# EAGLE design benchBuddy (EAGLE 9.1.2)

## Sheet 1 of 2: PSU Schematic from Class
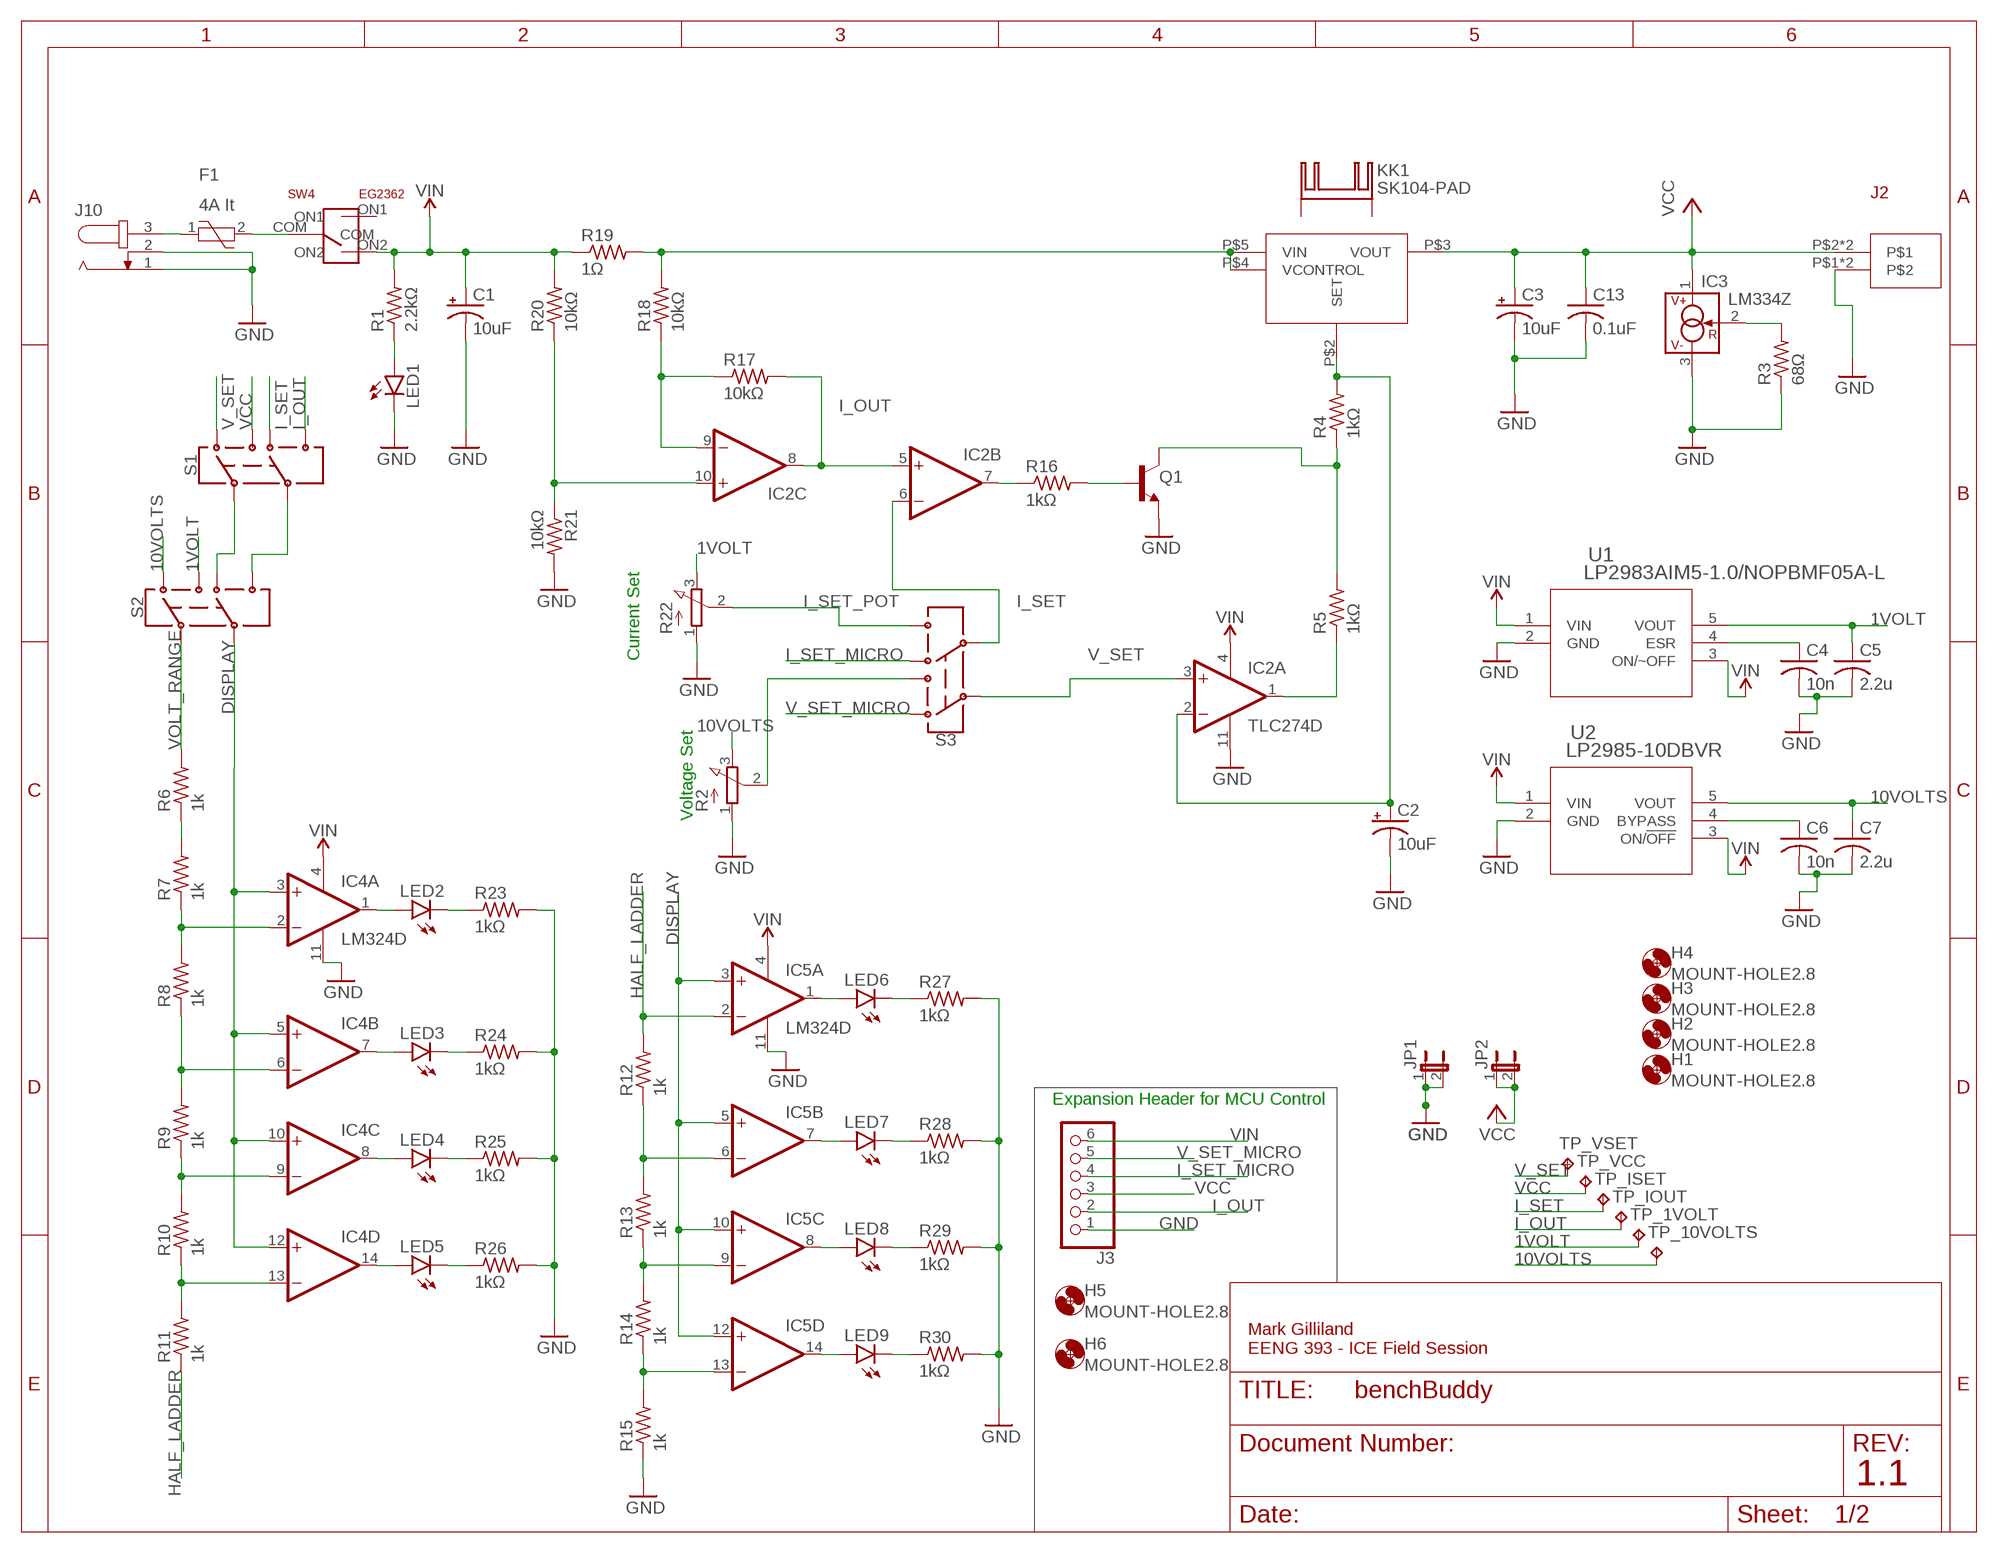
[diagram p0: schematic, sheet 1]

### Parts
C1  10uF  CPOL-USB  [PANASONIC_B]
C2  10uF  CPOL-USB  [PANASONIC_B]
C3  10uF  CPOL-USB  [PANASONIC_B]
C4  10n  C-USC1206  [C1206]
C5  2.2u  C-USC1206  [C1206]
C6  10n  C-USC1206  [C1206]
C7  2.2u  C-USC1206  [C1206]
C13  0.1uF  C-USC0805  [C0805]
F1  4A It  FUSE  [LITTELFUSE_MINISMDC260F/12-2]
H1  MOUNT-HOLE2.8  [2,8]
H2  MOUNT-HOLE2.8  [2,8]
H3  MOUNT-HOLE2.8  [2,8]
H4  MOUNT-HOLE2.8  [2,8]
H5  MOUNT-HOLE2.8  [2,8]
H6  MOUNT-HOLE2.8  [2,8]
IC2  TLC274D  [SO14]
IC3  LM334Z  [TO92]
IC4  LM324D  [SO14]
IC5  LM324D  [SO14]
J2  PHOENIX_SPRING_TERM_2POS  [SPRING_TERM_2POS]
J3  PINHD-1X6  [1X06]
J10  JACK-PLUG0  [SPC4077]
JP1  JP1E  [JP1]
JP2  JP1E  [JP1]
KK1  SK104-PAD  [SK104-PAD]
LED1  LEDCHIPLED_1206  [CHIPLED_1206]
LED2  LEDCHIPLED_1206  [CHIPLED_1206]
LED3  LEDCHIPLED_1206  [CHIPLED_1206]
LED4  LEDCHIPLED_1206  [CHIPLED_1206]
LED5  LEDCHIPLED_1206  [CHIPLED_1206]
LED6  LEDCHIPLED_1206  [CHIPLED_1206]
LED7  LEDCHIPLED_1206  [CHIPLED_1206]
LED8  LEDCHIPLED_1206  [CHIPLED_1206]
LED9  LEDCHIPLED_1206  [CHIPLED_1206]
Q1  600mA/40V  TRANS_NPN-MMBT2222AL  [SOT23-3]
R1  2.2kΩ  R-US_R1206  [R1206]
R2  EVUF2A  [EVUF]
R3  68Ω  R-US_R1206  [R1206]
R4  1kΩ  R-US_R1206  [R1206]
R5  1kΩ  R-US_R1206  [R1206]
R6  1k  R-US_R1206  [R1206]
R7  1k  R-US_R1206  [R1206]
R8  1k  R-US_R1206  [R1206]
R9  1k  R-US_R1206  [R1206]
R10  1k  R-US_R1206  [R1206]
R11  1k  R-US_R1206  [R1206]
R12  1k  R-US_R1206  [R1206]
R13  1k  R-US_R1206  [R1206]
R14  1k  R-US_R1206  [R1206]
R15  1k  R-US_R1206  [R1206]
R16  1kΩ  R-US_R1206  [R1206]
R17  10kΩ  R-US_R1206  [R1206]
R18  10kΩ  R-US_R1206  [R1206]
R19  1Ω  R-US_0411/15  [0411/15]
R20  10kΩ  R-US_R1206  [R1206]
R21  10kΩ  R-US_R1206  [R1206]
R22  EVUF2A  [EVUF]
R23  1kΩ  R-US_R1206  [R1206]
R24  1kΩ  R-US_R1206  [R1206]
R25  1kΩ  R-US_R1206  [R1206]
R26  1kΩ  R-US_R1206  [R1206]
R27  1kΩ  R-US_R1206  [R1206]
R28  1kΩ  R-US_R1206  [R1206]
R29  1kΩ  R-US_R1206  [R1206]
R30  1kΩ  R-US_R1206  [R1206]
S1  SWITCH-DPDT-SMD-AYZ0202  [SWITCH_DPDT_SMD_AYZ0202]
S2  SWITCH-DPDT-SMD-AYZ0202  [SWITCH_DPDT_SMD_AYZ0202]
S3  SWITCH-DPDT-SMD-AYZ0202  [SWITCH_DPDT_SMD_AYZ0202]
SW4  EG2362  [SWITCH_EG2362-ND]
TP_1VOLT  TPB1,27  [B1,27]
TP_10VOLTS  TPB1,27  [B1,27]
TP_IOUT  TPB1,27  [B1,27]
TP_ISET  TPB1,27  [B1,27]
TP_VCC  TPB1,27  [B1,27]
TP_VSET  TPB1,27  [B1,27]
U1  LP2983AIM5-1.0/NOPBMF05A-L  [MF05A-L]
U2  LP2985-10DBVR  [DBV5]
U$1  LT3080  [TO-220-5R]

### Nets
1VOLT: C5.1 R22.3(E) S2.3 TP_1VOLT.TP U1.5(VOUT) ; also sheet 2
10VOLTS: C7.1 R2.3(E) S2.1 TP_10VOLTS.TP U2.5(VOUT) ; also sheet 2
DISPLAY: IC4.3(A:+IN) IC4.5(B:+IN) IC4.10(C:+IN) IC4.12(D:+IN) IC5.3(A:+IN) IC5.5(B:+IN) IC5.10(C:+IN) IC5.12(D:+IN) S2.5
GND: C1.- C2.- C3.- C4.2 C5.2 C6.2 C7.2 C13.2 IC2.11(P:V-) IC3.3(V-) IC4.11(P:V-) IC5.11(P:V-) J2.P$1 J2.P$3 J3.1 J10.1 J10.2 JP1.1 JP1.2 LED1.C Q1.2(E) R2.1(A) R3.1 R15.1 R21.2 R22.1(A) R23.2 R24.2 R25.2 R26.2 R27.2 R28.2 R29.2 R30.2 U1.2(GND) U2.2(GND) ; also sheet 2
HALF_LADDER: IC5.2(A:-IN) R11.1 R12.2
I_OUT: IC2.5(B:+IN) IC2.8(C:OUT) J3.2 R17.2 S1.6 TP_IOUT.TP ; also sheet 2
I_SET: IC2.6(B:-IN) S1.4 S3.5 TP_ISET.TP ; also sheet 2
I_SET_MICRO: J3.4 S3.4
I_SET_POT: R22.2(S) S3.6
N$1: LED1.A R1.1
N$2: IC3.2(R) R3.2
N$3: F1.1 J10.3
N$5: Q1.3(C) R4.1 R5.2
N$6: C2.+ IC2.2(A:-IN) R4.2 U$1.P$2(SET)
N$8: R6.1 R7.2
N$9: IC5.13(D:-IN) R14.1 R15.2
N$10: IC5.9(C:-IN) R13.1 R14.2
N$11: IC5.6(B:-IN) R12.1 R13.2
N$13: IC4.2(A:-IN) R7.1 R8.2
N$14: IC4.6(B:-IN) R8.1 R9.2
N$15: IC4.9(C:-IN) R9.1 R10.2
N$16: IC4.13(D:-IN) R10.1 R11.2
N$17: IC2.10(C:+IN) R20.1 R21.1
N$18: IC2.9(C:-IN) R17.1 R18.1
N$19: R18.2 R19.2 U$1.P$4(VCONTROL) U$1.P$5(VIN)
N$20: C6.1 U2.4(BYPASS)
N$21: IC2.7(B:OUT) R16.1
N$23: Q1.1(B) R16.2
N$24: IC4.1(A:OUT) LED2.A
N$25: LED2.C R23.1
N$26: LED3.C R24.1
N$27: LED4.C R25.1
N$28: LED5.C R26.1
N$29: LED6.C R27.1
N$30: LED7.C R28.1
N$31: LED8.C R29.1
N$32: LED9.C R30.1
N$33: IC5.1(A:OUT) LED6.A
N$34: IC5.7(B:OUT) LED7.A
N$35: IC5.8(C:OUT) LED8.A
N$36: IC5.14(D:OUT) LED9.A
N$38: C4.1 U1.4(ESR)
N$39: S1.2 S2.4
N$40: S1.5 S2.6
N$44: F1.2 SW4.COM
N$45: IC4.7(B:OUT) LED3.A
N$46: IC4.8(C:OUT) LED4.A
N$47: IC4.14(D:OUT) LED5.A
V_OUT: IC2.1(A:OUT) R5.1
V_SET: IC2.3(A:+IN) S1.1 S3.2 TP_VSET.TP ; also sheet 2
V_SET_MICRO: J3.5 S3.1
V_SET_POT: R2.2(S) S3.3
VCC: C3.+ C13.1 IC3.1(V+) J2.P$2 J2.P$4 J3.3 JP2.1 JP2.2 S1.3 TP_VCC.TP U$1.P$3(VOUT) ; also sheet 2
VIN: C1.+ IC2.4(P:V+) IC4.4(P:V+) IC5.4(P:V+) J3.6 R1.2 R19.1 R20.2 SW4.ON2 U1.1(VIN) U1.3(ON/~OFF) U2.1(VIN) U2.3(ON/!OFF) ; also sheet 2
VOLT_RANGE: R6.2 S2.2
Unconnected: IC2.12(D:+IN) IC2.13(D:-IN) IC2.14(D:OUT) KK1.K1(K) KK1.K2(K)

### Notes on the sheet
- Current Set
- Voltage Set
- Expansion Header for MCU Control
- Mark Gilliland
  EENG 393 - ICE Field Session
- 1.1

## Sheet 2 of 2: Extra Power Supplies
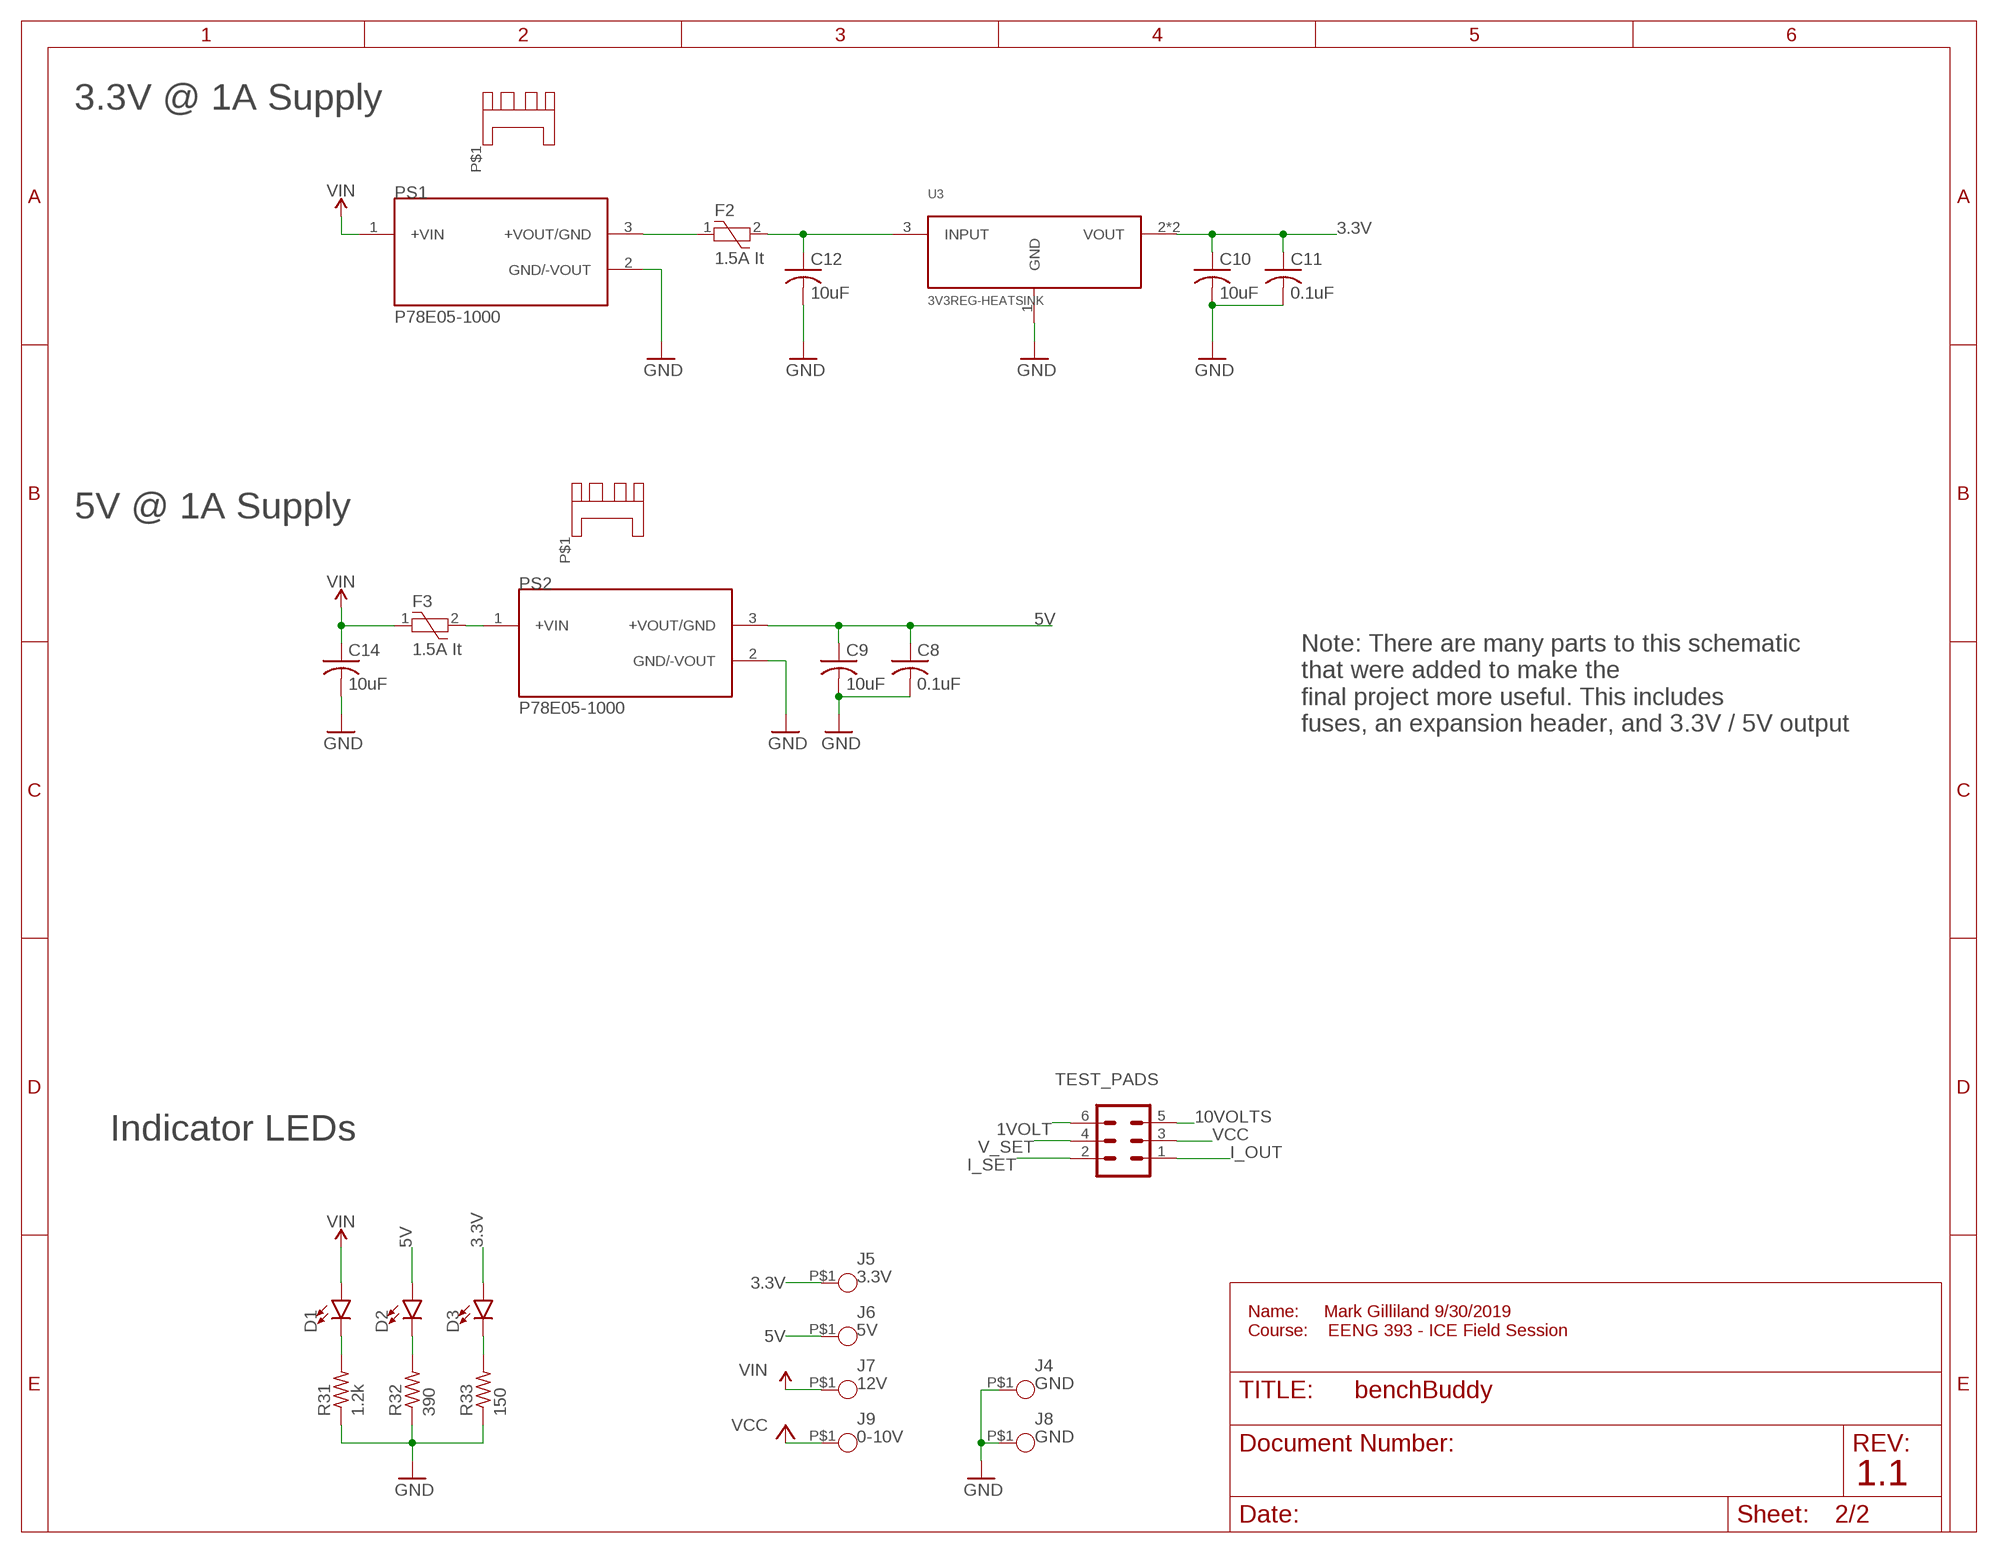
[diagram p1: schematic, sheet 2]

### Parts
C8  0.1uF  C-USC0805  [C0805]
C9  10uF  C-USC0805  [C0805]
C10  10uF  C-USC0805  [C0805]
C11  0.1uF  C-USC0805  [C0805]
C12  10uF  C-USC0805  [C0805]
C14  10uF  C-USC0805  [C0805]
D1  LED3MM  [LED_3MM]
D2  LED3MM  [LED_3MM]
D3  LED3MM  [LED_3MM]
F2  1.5A It  FUSE  [LITTELFUSE_MINISMDC260F/12-2]
F3  1.5A It  FUSE  [LITTELFUSE_MINISMDC260F/12-2]
J4  GND  FAT-WIRE-TERM  [FAT-PAD]
J5  3.3V  FAT-WIRE-TERM  [FAT-PAD]
J6  5V  FAT-WIRE-TERM  [FAT-PAD]
J7  12V  FAT-WIRE-TERM  [FAT-PAD]
J8  GND  FAT-WIRE-TERM  [FAT-PAD]
J9  0-10V  FAT-WIRE-TERM  [FAT-PAD]
PS1  P78E05-1000  [CONV_P78E05-1000]
PS2  P78E05-1000  [CONV_P78E05-1000]
R31  1.2k  R-US_R1206  [R1206]
R32  390  R-US_R1206  [R1206]
R33  150  R-US_R1206  [R1206]
TEST_PADS  CONN_03X2NO_SILK  [2X3-NS]
U3  3V3REG-HEATSINK  [SOT223-HS]
U$2  HEATSINK_MINI  [HEATSINK_MINI]
U$3  HEATSINK_MINI  [HEATSINK_MINI]

### Nets
1VOLT: TEST_PADS.6 ; also sheet 1
3.3V: C10.1 C11.1 D3.A J5.P$1 U3.2(VOUT) U3.4(VOUT)
5V: C8.1 C9.1 D2.A J6.P$1 PS2.3(+VOUT/GND)
10VOLTS: TEST_PADS.5 ; also sheet 1
GND: C8.2 C9.2 C10.2 C11.2 C12.2 C14.2 J4.P$1 J8.P$1 PS1.2(GND/-VOUT) PS2.2(GND/-VOUT) R31.1 R32.1 R33.1 U3.1(GND) ; also sheet 1
I_OUT: TEST_PADS.1 ; also sheet 1
I_SET: TEST_PADS.2 ; also sheet 1
N$7: F3.2 PS2.1(+VIN)
N$41: D1.K(C) R31.2
N$42: D2.K(C) R32.2
N$43: D3.K(C) R33.2
N$48: F2.1 PS1.3(+VOUT/GND)
N$49: C12.1 F2.2 U3.3(INPUT)
V_SET: TEST_PADS.4 ; also sheet 1
VCC: J9.P$1 TEST_PADS.3 ; also sheet 1
VIN: C14.1 D1.A F3.1 J7.P$1 PS1.1(+VIN) ; also sheet 1
Unconnected: U$2.P$1 U$3.P$1

### Notes on the sheet
- 3.3V @ 1A Supply
- 5V @ 1A Supply
- Note: There are many parts to this schematic
  that were added to make the
  final project more useful. This includes
  fuses, an expansion header, and 3.3V / 5V output
- Indicator LEDs
- Name:     Mark Gilliland 9/30/2019
  Course:    EENG 393 - ICE Field Session
- 1.1

## Power pins joined to a net without a drawn wire
ON1: SW4.ON1

## Library data of the parts
C1-C3 = rcl:CPOL-US: POLARIZED CAPACITOR, American symbol; SPICEPREFIX: C
C4-C14 = rcl:C-US: CAPACITOR, American symbol; SPICEPREFIX: C
D1-D3 = SparkFun-LED:LED: LED (Generic) Standard schematic elements and footprints for 5mm, 3mm, 1206, and 0603 sized LEDs. Generic LEDs with no color specified.; PROD_ID: DIO-08794
F1-F3 = lab07lib:FUSE
H1-H6 = holes:MOUNT-HOLE: MOUNTING HOLE with drill center marker
IC2 = linear:TLC274: OP AMP
IC3 = linear:LM*34: 3-Terminal Adjustable Current Sources Source: www.national.com/pf/LM/LM334.html | LM134.pdf
IC4 IC5 = linear:LM324: OP AMP
J2 = lab07lib:PHOENIX_SPRING_TERM_2POS
J3 = pinhead:PINHD-1X6: PIN HEADER
J4-J9 = lab07lib:FAT-WIRE-TERM: Fat wire terminal, for 14AWG wire connections. Provides fat pad so that it doesn't get torn off.
J10 = con-jack:JACK-PLUG: DC POWER JACK Power Jack, DC, Right Angle, Through Hole, Rated 5A at 16VDC, PC Terminals Distributor: Farnell (www.Farnell.de) Drawing: 84N1161.pdf / 84N1162.pdf Manufacturer: SPC Technology (www.spctechnology.com) Type: SPC4077 / SPC 4078; OC_FARNELL: unknown; OC_NEWARK: unknown
JP1 JP2 = jumper:JP1E: JUMPER
KK1 = heatsink:SK104-PAD: HEATSINK manufacturer Fischer/distributor Buerklin
LED1-LED9 = led:LED: LED OSRAM: - CHIPLED LG R971, LG N971, LY N971, LG Q971, LY Q971, LO R971, LY R971 LH N974, LH R974 LS Q976, LO Q976, LY Q976 LO Q996 - Hyper CHIPLED LW Q18S LB Q993, LB Q99A, LB R99A - SideLED LS A670, LO A670, LY A670, LG A670, LP A670 LB A673, LV A673, LT A673, LW A673 LH A674 LY A675 LS A676, LA A676, LO A676, LY A676, LW A676 LS A679, LY A679, LG A679 - Hyper Micro SIDELED® LS Y876, LA Y876, LO Y876, LY Y876 LT Y87S - SmartLED LW L88C, LW L88S LB L89C, LB L89S, LG L890 LS L89K, LO L89K, LY L89K LS L896, LA L896, LO L896, LY L896 - TOPLED LS T670, LO T670, LY T670, LG T670, LP T670 LSG T670, LSP T670, LSY T670, LOP T670, LYG T670 LG T671, LOG T671, LSG T671 LB T673, LV T673, LT T673, LW T673 LH T674 LS T676, LA T676, LO T676, LY T676, LB T676, LH T676, LSB T676, LW T676 LB T67C, LV T67C, LT T67C, LS T67K, LO T67K, LY T67K, LW E67C LS E67B, LA E67B, LO E67B, LY E67B, LB E67C, LV E67C, LT E67C LW T67C LS T679, LY T679, LG T679 LS T770, LO T770, LY T770, LG T770, LP T770 LB T773, LV T773, LT T773, LW T773 LH T774 LS E675, LA E675, LY E675, LS T675 LS T776, LA T776, LO T776, LY T776, LB T776 LHGB T686 LT T68C, LB T68C - Hyper Mini TOPLED® LB M676 - Mini TOPLED Santana® LG M470 LS M47K, LO M47K, LY M47K Source: http://www.osram.convergy.de LUXEON: - LUMILED® LXK2-PW12-R00, LXK2-PW12-S00, LXK2-PW14-U00, LXK2-PW14-V00 LXK2-PM12-R00, LXK2-PM12-S00, LXK2-PM14-U00 LXK2-PE12-Q00, LXK2-PE12-R00, LXK2-PE12-S00, LXK2-PE14-T00, LXK2-PE14-U00 LXK2-PB12-K00, LXK2-PB12-L00, LXK2-PB12-M00, LXK2-PB14-N00, LXK2-PB14-P00, LXK2-PB14-Q00 LXK2-PR12-L00, LXK2-PR12-M00, LXK2-PR14-Q00, LXK2-PR14-R00 LXK2-PD12-Q00, LXK2-PD12-R00, LXK2-PD12-S00 LXK2-PH12-R00, LXK2-PH12-S00 LXK2-PL12-P00, LXK2-PL12-Q00, LXK2-PL12-R00 Source: www.luxeon.com KINGBRIGHT: KA-3528ASYC Source: www.kingbright.com
PS1 PS2 = P78E05-1000:P78E05-1000: NON-ISOLATED DC SWITCHING REGULATOR; MANUFACTURER: CUI Inc; STANDARD: Manufacturer Recommendations
Q1 = SparkFun-DiscreteSemi:TRANS_NPN: NPN transistor Current controlled devices typically used to amplify current or used as a switch. BC547 - COM-08928 <http://www.sparkfun.com/products/8928> (TO-92 45V 100mA) (1.Collector 2.Base 3.Emitter) 2N3904 - COM-00521 <http://www.sparkfun.com/products/521> (TO-92 40V 200mA) (1.Emitter 2.Base 3.Collector) P2N2222A - COM-12852 <http://www.sparkfun.com/products/12852> (TO-92 40V 600mA) (1.Collector 2.Base 3.Emitter); PROD_ID: TRANS-08049
R1 R3-R21 R23-R33 = rcl:R-US_: RESISTOR, American symbol; SPICEPREFIX: R
R2 R22 = pot:EVU: 9 mm Square Rotary Potentiometers Source: Panasonic
S1-S3 = SparkFun-Switches:SWITCH-DPDT: Double-Pole, Double-Throw (DPDT) Switch Double-pole, double-throw switches. Variant Overview PTH-GPI-152-3013 Used on SparkFun Geiger Counter <https://www.sparkfun.com/products/11345> SMD-AY0202 Surface Mount DPDT Switch <https://www.sparkfun.com/products/597> (COM-00597) Used on e.g. LilyPad Arduino USB - ATmega32U4 Board <https://www.sparkfun.com/products/12049>; PROD_ID: SWCH-08179; SF_SKU: COM-00597
SW4 = lab07lib:EG2362
TEST_PADS = SparkFun-Connectors:CONN_03X2: Multi connection point. Often used as Generic Header-pin footprint for 0.1 inch spaced/style header connections You can populate with any combo of single row headers, but if you'd like an exact match, check these: Header - 2x3 (Male, 0.1") <https://www.sparkfun.com/products/12807> (PRT-12807) Header - 2x3 (Female, 0.1") <https://www.sparkfun.com/products/13010> (PRT-13010) 2x3 Pin Shrouded Header <https://www.sparkfun.com/products/10877> (PRT-10877) On any of the 0.1 inch spaced packages, you can populate with these: Break Away Headers - Straight <https://www.sparkfun.com/products/116> (PRT-00116) Break Away Male Headers - Right Angle <https://www.sparkfun.com/products/553> (PRT-00553) Female Headers <https://www.sparkfun.com/products/115> (PRT-00115) Break Away Headers - Machine Pin <https://www.sparkfun.com/products/117> (PRT-00117) Break Away Female Headers - Swiss Machine Pin <https://www.sparkfun.com/products/743> (PRT-00743) Special note: the shrouded connector mates well with our 3x2 ribbon cables: Ribbon Crimp Connector - 6-pin (2x3, Female) <https://www.sparkfun.com/products/10651> (PRT-10651) Ribbon Cable - 6 wire (15ft) <https://www.sparkfun.com/products/10646> (PRT-10646)
TP_1VOLT TP_10VOLTS TP_IOUT TP_ISET TP_VCC TP_VSET = testpad:TP: Test pad
U1 = lab07lib:LP2983AIM5-1.0/NOPB; MANUFACTURER_PART_NUMBER: LP2983AIM51.0NOPB; VENDOR: Texas Instruments
U2 = lab07lib:LP2985-10DBVR; MANUFACTURER_PART_NUMBER: LP298510DBVR; VENDOR: Texas Instruments
U3 = lab07lib:3V3REG: Cheap 3.3V VReg, Linear SOT223, 1A AP2114HA-3.3TRG1
U$1 = lab07lib:LT3080
U$2 U$3 = lab07lib:HEATSINK_MINI

## Board
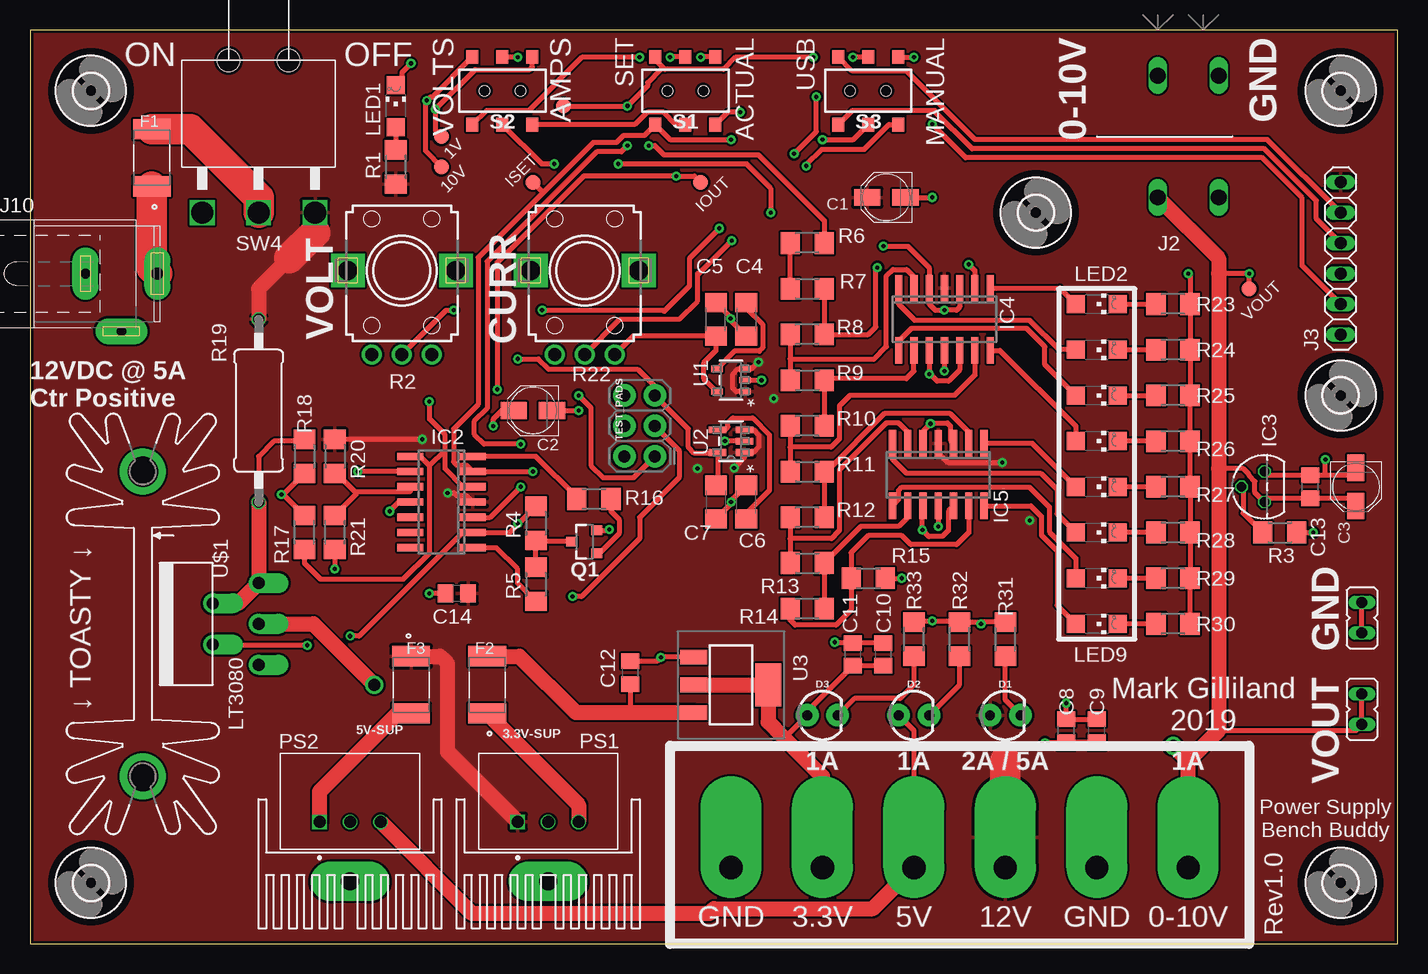
[diagram p2: board, top side]
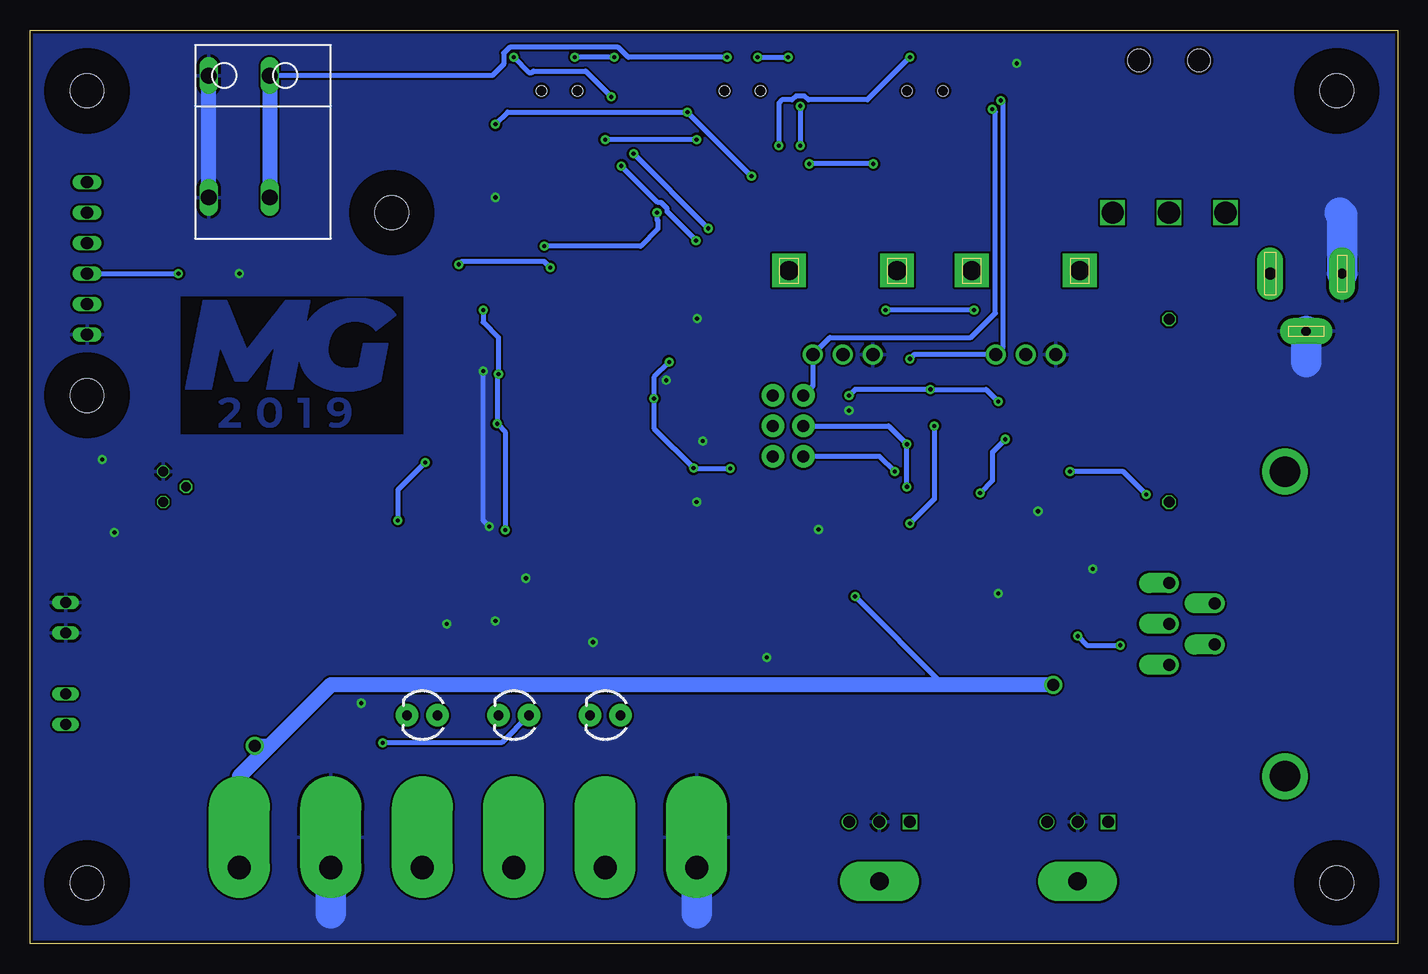
[diagram p3: board, bottom side, seen from below]

Size 113.97 x 76.19 mm. Coordinates in mm from the lower left corner, seen from the top.
Outline: 0,0 113.97,0 113.97,76.19 0,76.19 0,0
Copper layers (1*16): Top 0.0356mm / dielectric 1.5011mm / Bottom 0.0356mm
Design rules "PCBway": minimum track width 7mil, minimum drill 10mil, track to track 7mil, track to pad 7mil, pad to pad 7mil, via to via 7mil, smd to smd 0mil, copper to edge 10mil, drill to drill 10mil, minimum pad ring 4mil, minimum via ring 8mil, stop-mask expansion 4mil, vias tented up to drill 0mil, thermal gap 10mil
bKeepout: area 82.9,42.5 to 101.4,42.5; area 82.9,42.5 to 101.4,42.5; area 82.9,42.5 to 101.4,42.6; area 82.9,42.6 to 101.4,42.6; area 82.9,42.6 to 101.4,42.6; area 82.9,42.6 to 101.4,42.7; area 82.9,42.7 to 101.4,42.7; area 82.9,42.7 to 101.4,42.7; area 82.9,42.7 to 101.4,42.7; area 82.9,42.7 to 101.4,42.8; area 82.9,42.8 to 101.4,42.8; area 82.9,42.8 to 101.4,42.8; 1752 more areas
bRestrict: area 82.9,42.5 to 101.4,42.5; area 82.9,42.5 to 101.4,42.5; area 82.9,42.5 to 101.4,42.6; area 82.9,42.6 to 101.4,42.6; area 82.9,42.6 to 101.4,42.6; area 82.9,42.6 to 101.4,42.7; area 82.9,42.7 to 101.4,42.7; area 82.9,42.7 to 101.4,42.7; area 82.9,42.7 to 101.4,42.7; area 82.9,42.7 to 101.4,42.8; area 82.9,42.8 to 101.4,42.8; area 82.9,42.8 to 101.4,42.8; 1752 more areas

### Footprints (pad centres in the part's own frame; a part is rotated, then mirrored left to right if it is on the bottom)
PANASONIC_B = smd 2.2 x 1.4: + 1.6,0; - -1.6,0
C1206 = smd 1.6 x 1.8: 1 -1.4,0; 2 1.4,0
C0805 = smd 1.3 x 1.5: 1 -0.95,0; 2 0.95,0
LED_3MM = drill 0.813 pad 1.88: A -1.27,0; K 1.27,0
LITTELFUSE_MINISMDC260F/12-2 = smd 1.68 x 3.15: 1 -2.39,0; 2 2.39,0
2,8 = hole 2.8: 0,0
SO14 = smd 0.6 x 2.2: 1 -3.81,-2.6; 2 -2.54,-2.6; 3 -1.27,-2.6; 4 0,-2.6; 5 1.27,-2.6; 6 2.54,-2.6; 7 3.81,-2.6; 8 3.81,2.6; 9 2.54,2.6; 10 1.27,2.6; 11 0,2.6; 12 -1.27,2.6; 13 -2.54,2.6; 14 -3.81,2.6
TO92 = drill 0.813 octagon: 1 -1.27,0; 2 0,1.905; 3 1.27,0
SPRING_TERM_2POS = drill 1.321 long: P$1 5.08,0; P$2 0,0; P$3 5.08,10.16; P$4 0,10.16
1X06 = drill 1.016 long: 1 -6.35,0; 2 -3.81,0; 3 -1.27,0; 4 1.27,0; 5 3.81,0; 6 6.35,0
FAT-PAD = drill 1.93 pad 5.08 offset: P$1 0,0
SPC4077 = drill 0.8 pad 2.184 long: 1 -3,0; 2 0,-4.8 | drill 1 pad 2.184 long: 3 3,0
JP1 = drill 0.914 long: 1 0,-1.27; 2 0,1.27
SK104-PAD = drill 2.54 pad 3.81: K1 -12.7,-0.762; K2 12.7,-0.762
CHIPLED_1206 = smd 1.5 x 1.5: A 0,-1.75; C 0,1.75
CONV_P78E05-1000 = drill 1 square: 1 -2.54,0 | drill 1: 2 0,0; 3 2.54,0
SOT23-3 = smd 0.8 x 0.9: 1 -0.95,-1; 2 0.95,-1; 3 0,1.1
R1206 = smd 1.6 x 1.803: 1 -1.422,0; 2 1.422,0
EVUF = drill 1.1 pad 1.676: 1 -2.5,-7; 2 0,-7; 3 2.5,-7 | drill 1.6 pad 2.8 square: M1 4.5,0; M2 -4.5,0
0411/15 = drill 0.914 octagon: 1 -7.62,0; 2 7.62,0
SWITCH_DPDT_SMD_AYZ0202 = smd 1 x 1.15: 1 -2.5,2.825; 2 0,2.825; 3 2.5,2.825; 4 -2.5,-2.825; 5 0,-2.825; 6 2.5,-2.825 | hole 0.85: 1.5,0; -1.5,0
SWITCH_EG2362-ND = drill 1.85 square: COM 0,0; ON1 -4.7,0; ON2 4.7,0 | hole 1.85: 2.5,12.7; -2.5,12.7
2X3-NS = drill 1.016 pad 1.88: 1 -2.54,-1.27; 2 -2.54,1.27; 3 0,-1.27; 4 0,1.27; 5 2.54,-1.27; 6 2.54,1.27
B1,27 = smd 1.27 x 1.27: TP 0,0
MF05A-L = smd 0.965 x 0.508: 1 -1.168,0.953; 2 -1.168,0; 3 -1.168,-0.953; 4 1.168,-0.953; 5 1.168,0.953
DBV5 = smd 1.473 x 0.559: 1 -1.118,0.95; 2 -1.118,0; 3 -1.118,-0.95; 4 1.118,-0.95; 5 1.118,0.95
SOT223-HS = smd 1.219 x 2.235: 1 -2.311,-3.099; 2 0,-3.099; 3 2.311,-3.099 | smd 3.6 x 2.2: 4 0,3.099
TO-220-5R = drill 1 pad 1.676 offset: P$1 -3.404,-3.81; P$2 -1.727,0; P$3 0,-3.81; P$4 1.727,0; P$5 3.404,-3.81
HEATSINK_MINI = drill 1.524 pad 3.302 long: P$1 0,2.413

### Placement (x,y rotation side)
C1  71.37,62.23 180 top
C2  41.91,44.45 180 top
C3  110.49,38.1 270 top
C4  59.69,52.07 270 top
C5  57.15,52.07 90 top
C6  59.69,36.83 90 top
C7  57.15,36.83 270 top
C8  86.36,17.78 90 top
C9  88.9,17.78 90 top
C10  71.12,24.13 90 top
C11  68.58,24.13 90 top
C12  50.04,22.61 90 top
C13  106.68,38.1 90 top
C14  35.56,29.21 180 top
D1  81.28,19.05 0 top
D2  73.66,19.05 0 top
D3  66.04,19.05 0 top
F1  10.16,65.53 90 top
F2  38.1,21.59 90 top
F3  31.75,21.59 270 top
H1  5.08,5.08 0 top
H2  109.22,71.12 0 top
H3  109.22,5.08 0 top
H4  5.08,71.12 0 top
H5  109.22,45.72 0 top
H6  83.82,60.96 0 top
IC2  34.29,36.83 90 top
IC3  102.87,38.1 90 top
IC4  76.2,52.07 180 top
IC5  75.69,39.12 180 top
J2  93.98,62.23 0 top
J3  109.22,57.15 90 top
J4  58.42,6.35 0 top
J5  66.04,6.35 0 top
J6  73.66,6.35 0 top
J7  81.28,6.35 0 top
J8  88.9,6.35 0 top
J9  96.52,6.35 0 top
J10  7.62,55.88 0 top
JP1  111,27.18 0 top
JP2  111,19.56 0 top
KK1  10.16,26.67 270 top
LED1  30.48,69.85 0 top
LED2  88.9,53.34 270 top
LED3  88.9,49.53 270 top
LED4  88.9,45.72 270 top
LED5  88.9,41.91 270 top
LED6  88.9,38.1 270 top
LED7  88.9,34.29 270 top
LED8  88.9,30.48 270 top
LED9  88.9,26.67 270 top
PS1  43.18,10.16 0 top
PS2  26.67,10.16 0 top
Q1  46.23,33.53 90 top
R1  30.48,64.77 270 top
R2  30.99,56.13 0 top
R3  104.14,34.29 180 top
R4  42.16,35.05 90 top
R5  42.16,29.97 90 top
R6  64.77,58.42 0 top
R7  64.77,54.61 180 top
R8  64.77,50.8 0 top
R9  64.77,46.99 180 top
R10  64.77,43.18 0 top
R11  64.77,39.37 180 top
R12  64.77,35.56 0 top
R13  64.77,31.75 180 top
R14  64.77,27.94 0 top
R15  69.85,30.48 180 top
R16  46.99,37.08 0 top
R17  22.86,34.29 270 top
R18  22.86,40.64 90 top
R19  19.05,44.45 270 top
R20  25.4,40.64 90 top
R21  25.4,34.29 270 top
R22  46.23,56.13 0 top
R23  95.25,53.34 0 top
R24  95.25,49.53 0 top
R25  95.25,45.72 0 top
R26  95.25,41.91 0 top
R27  95.25,38.1 0 top
R28  95.25,34.29 0 top
R29  95.25,30.48 0 top
R30  95.25,26.67 0 top
R31  81.28,25.4 270 top
R32  77.47,25.4 270 top
R33  73.66,25.4 270 top
S1  54.61,71.12 0 top
S2  39.37,71.12 0 top
S3  69.85,71.12 0 top
SW4  19.05,60.96 0 top
TEST_PADS  50.8,43.18 90 top
TP_1VOLT  34.29,67.31 180 top
TP_10VOLTS  34.29,64.77 180 top
TP_IOUT  55.88,63.5 180 top
TP_ISET  41.91,63.5 180 top
TP_VCC  101.6,54.61 180 top
TP_VSET  44.45,69.85 180 top
U1  58.42,46.99 180 top
U2  58.42,41.91 180 top
U3  58.42,21.59 270 top
U$1  15.24,26.67 90 top
U$2  43.18,7.62 180 top
U$3  26.67,7.62 180 top

### Tracks (layer width: path | path; a pad name or v marks a point on that pad's centre or on a via)
1VOLT  (via drill 0.35)
  Top 0.406: U1.5 56.11,47.13 56.11,48.41 57.15,49.45 C5.1 50.26,50.67 R22.3 | S2.3 41.87,73.11 41.66,72.9 37.08,72.9 v33.78,69.6 33.78,67.82 TP_1VOLT.TP
  Bottom 0.406: v33.78,69.6 33.53,69.34 33.53,52.58 35.56,50.55 47.32,50.55 R22.3 48.73,46.52 TEST_PADS.6
3.3V
  Top 0.406: C10.1 C11.1 64.77,19.37 D3.A 62.99,17.27 62.74,17.27
  Top 1.27: J5.P$1 66.04,13.97 62.74,17.27 61.52,18.49 U3.4 U3.2
5V  (via drill 0.35)
  Top 0.406: D2.A 73.66,17.78 J6.P$1 | C9.1 C8.1 86.29,16.76 v84.58,16.76
  Top 1.27: J6.P$1 70.23,2.92 57,2.92 56.62,2.54 36.83,2.54 PS2.3
  Bottom 0.406: v84.58,16.76 74.68,16.76 D2.A
10VOLTS  (via drill 0.35, 0.35 pad 0.7)
  Top 0.406: C7.1 57.3,38.38 U2.5 57.24,40.89 55.37,40.89 54.86,41.4 54.86,42.93 52.61,45.18 52.07,45.18 TEST_PADS.5 52.07,46.48 50.64,47.91 43.22,47.91 42.37,48.77 v40.64,48.77 | S2.1 33.53,70.6 33.36,70.6 v33.07,70.31 33.07,70.06 32.95,69.94 32.95,66.11 TP_10VOLTS.TP
  Bottom 0.406: v33.07,70.31 32.87,70.11 32.87,49.75 R2.3 40.27,49.13 v40.64,48.77
DISPLAY  (via drill 0.35)
  Top 0.406: IC5.5 74.42,42.74 v75.04,43.36 75.12,43.43 76.45,43.43 76.71,43.18 76.71,41.97 IC5.3 | IC4.12 77.47,47.84 76.55,46.92 75.6,46.92 75.02,47.5 v74.93,47.5 IC4.10 | IC5.12 76.53,36.08 76.53,34.45 76.04,33.96 74.96,33.96 74.93,33.93 v74.37,34.49 74.37,36.47 IC5.10 | IC4.3 77.47,53.09 77.22,52.83 v76.2,52.83 75.44,52.83 74.93,53.34 IC4.5 74.93,56.39 73.15,58.17 v71.12,58.17 | S2.5 42.64,65.02 v43.69,65.02 | v49.02,65.02 59.69,65.02 61.72,62.99 v61.72,60.96
  Bottom 0.406: v76.2,52.83 76.2,51.82 74.93,50.55 v74.93,47.5 75.04,47.38 v75.04,43.36 74.37,42.69 v74.37,34.49 | v43.69,65.02 v49.02,65.02 | v61.72,60.96 61.72,60.37 61.65,60.3 61.65,59.61 63.09,58.17 v71.12,58.17
GND  (via drill 0.35)
  Top 0.406: R30.2 R29.2 R28.2 R27.2 R26.2 R25.2 R24.2 R23.2 96.67,55.73 v96.52,55.88 | C3.- 109.84,39.05 107.95,39.05 | 107.95,39.05 C13.2 103.19,39.05 IC3.3 | IC4.11 v76.2,47.75 | IC5.11 v75.69,34.8 | R21.2 v25.4,31.24 | IC2.11 30.73,36.83 v29.97,36.07 | Q1.2 48.19,34.48 v48.26,34.54 | 73.51,26.67 R33.1 73.76,26.92 v75.18,26.92 77.37,26.92 R32.1 79.1,26.82 v79.25,26.67 79.4,26.82 R31.1 | C10.2 C11.2 67.12,25.08 v67.06,25.15 | U3.1 52.6,23.9 v52.58,23.88 52.26,23.56 C12.2 | C9.2 C8.2 v86.36,20.07 | C2.- v45.72,44.45 | C7.2 58.42,36.7 v58.42,36.83 58.42,36.96 C6.2 | C5.2 58.38,52.24 v58.38,52.13 58.38,51.98 C4.2 | U1.2 v60.96,46.99 | C1.- v75.18,62.23 | C14.2 v33.27,29.21 | U2.2 v57.91,41.91 | JP1.1 JP1.2 | v31.75,73.41 30.99,72.64 30.99,72.11 LED1.C | R15.1 v72.64,30.48 | R3.1 v106.93,34.29 | 107.95,39.05 v107.95,40.39
  Bottom 0.406: v75.69,34.8 76.2,35.31 v76.2,47.75
  Bottom 1.27: J2.P$1 J2.P$3
  Bottom 2.54: J4.P$1 58.42,2.54 | J8.P$1 88.9,2.54 | J10.1 4.62,60.75 4.83,60.96 | J10.2 7.62,48.51
  pour Bottom: 113.97,0 0,0 0,76.19 113.97,76.19
  pour Bottom (no thermals): 82.8,54.36 101.6,54.36 101.6,42.16 82.8,42.16
HALF_LADDER
  Top 0.406: R12.2 R11.1 66.38,39.37 71.2,44.2 76.71,44.2 78.23,42.67 IC5.2
I_OUT  (via drill 0.35)
  Top 0.406: 33.27,39.88 32.51,40.64 IC2.8 | 33.27,39.88 33.27,32.56 31.12,30.41 24.2,30.41 22.86,31.75 R17.2 | IC2.5 36.11,38.1 34.59,39.62 34.59,41.19 | 34.59,41.19 34.59,42.46 33.27,43.78 v33.27,45.21 | 33.27,39.88 33.29,39.88 34.59,41.19 | J3.2 106.02,56.54 106.02,62.21 102.7,65.53 77.98,65.53 v75.18,68.33 | v59.18,69.34 58.16,69.34 S1.6 | v38.94,46.23 38.94,56.8 46.15,64.01 v53.85,64.01 55.37,64.01 TP_IOUT.TP | v45.72,45.72 46.74,44.7 46.74,39.88 47.75,38.86 50.29,38.86 TEST_PADS.1
  Bottom 0.406: v75.18,68.33 74.17,69.34 v59.18,69.34 v53.85,64.01 | v33.27,45.21 34.29,46.23 v38.94,46.23 45.21,46.23 v45.72,45.72
I_SET  (via drill 0.35)
  Top 0.406: S3.5 68.61,67.06 v66.04,67.06 | v58.42,67.06 53.34,67.06 52.11,68.29 S1.4 51.2,67.38 49.44,67.38 48.86,66.8 46.93,66.8 42.77,62.64 | 42.77,62.64 37.34,57.22 37.34,44.97 35.31,42.93 35.31,40.18 35.6,39.88 36.38,39.88 IC2.6 v41.91,39.37 | TP_ISET.TP 42.77,62.64
  Bottom 0.406: v58.42,67.06 v66.04,67.06 | v41.91,39.37 43.18,40.64 TEST_PADS.2
I_SET_MICRO
  Top 0.406: J3.4 107.19,60.45 107.19,61.98 102.87,66.29 78.51,66.29 75.41,69.39 75.41,69.48 68.53,69.48 S3.4
I_SET_POT  (via drill 0.35)
  Top 0.406: R22.2 49.16,52.07 54.1,52.07 55.63,53.59 55.63,55.88 55.72,55.88 v58.47,58.62 | S3.6 71.57,68.3 69.5,66.22 65.97,66.22 64.69,64.95 v64.69,64.85
  Bottom 0.406: v58.47,58.62 60.89,61.04 60.89,61.31 61.38,61.8 61.64,61.8 v64.69,64.85
N$1
  Top 0.406: LED1.A R1.1
N$2
  Top 0.406: IC3.2 101.09,37.97 101.09,35.92 R3.2
N$3
  Top 2.54: F1.1 10.16,56.34 J10.3
N$5
  Top 0.406: R5.2 R4.1 42.27,33.53 Q1.3
N$6  (via drill 0.35)
  Top 0.406: C2.+ 39.29,44.45 38.61,43.76 v38.61,43.18 | R4.2 40.74,35.05 v40.64,35.05 40.64,34.95 39.98,34.29 IC2.2 36.07,34.29 27.43,25.65 v26.67,25.65 | v23.11,24.89 15.29,24.89 U$1.P$2
  Bottom 0.406: v38.61,43.18 38.61,37.08 v40.64,35.05 | v26.67,25.65 25.91,24.89 v23.11,24.89
N$7
  Top 1.27: PS2.1 24.13,12.7 30.63,19.2 F3.2
N$8
  Top 0.406: R7.2 R6.1
N$9
  Top 0.406: IC5.13 78.23,34.29 77.22,33.27 73.41,33.27 72.64,34.04 69.85,34.04 68.43,32.61 R15.2 68.43,27.83 67.18,26.58 63.77,26.58 63.35,27 R14.1
N$10
  Top 0.406: R14.2 R13.1 69.24,34.8 72.39,34.8 73.15,35.56 IC5.9
N$11
  Top 0.406: R12.1 63.35,33.78 | 63.35,33.78 R13.2 | IC5.6 73.15,42.67 72.39,43.43 71.37,43.43 67.45,39.51 67.45,34.47 67.06,34.08 67.06,34.04 66.8,33.78 63.35,33.78
N$13  (via drill 0.35)
  Top 0.406: R7.1 R8.2 69.85,50.8 70.48,51.44 70.48,56.26 v70.61,56.39 | v78.23,56.64 78.74,56.13 IC4.2
  Bottom 0.406: v70.61,56.39 71.12,56.9 77.98,56.9 v78.23,56.64
N$14
  Top 0.406: R8.1 63.35,48.77 | 63.35,48.77 R9.2 | IC4.6 73.66,55.63 73.06,56.23 71.9,56.23 71.37,55.7 71.37,49.78 70.36,48.77 63.35,48.77
N$15
  Top 0.406: R10.2 R9.1 66.32,47.12 73.03,47.12 73.66,47.75 IC4.9
N$16
  Top 0.406: R10.1 63.35,41.4 | 63.35,41.4 R11.2 | IC4.13 78.73,47.42 77.04,45.72 68.33,45.72 67.45,44.84 67.45,42.09 66.76,41.4 63.35,41.4
N$17
  Top 0.406: R20.1 25.55,39.22 27.05,37.72 | 27.05,37.72 27.18,37.59 27.18,37.49 R21.1 | 27.05,37.72 31.69,37.72 IC2.10
N$18  (via drill 0.35)
  Top 0.406: R18.1 21.11,37.47 | v20.95,37.47 21.11,37.47 | 21.11,37.47 R17.1 | IC2.9 v27.3,39.37
  Bottom 0.406: v20.95,37.47 22.86,39.37 v27.3,39.37
N$19
  Top 0.406: R18.2 22.71,41.91 20.32,41.91 19.05,40.64 R19.2
  Top 1.27: R19.2 U$1.P$5 17.37,28.4 U$1.P$4
N$20
  Top 0.406: C6.1 59.69,35.88 61.62,37.81 61.62,42.44 60.21,43.85 58.58,43.85 58.17,43.43 58.17,43.1 57.86,42.8 57.8,42.86 U2.4
N$21
  Top 0.406: R16.1 45.57,37.24 42.16,40.64 IC2.7
N$23
  Top 0.406: Q1.1 47.48,32.58 49.09,34.2 49.09,35.4 48.41,36.08 R16.2
N$24
  Top 0.406: IC4.1 85.82,54.67 LED2.A
N$25
  Top 0.406: LED2.C R23.1
N$26
  Top 0.406: LED3.C R24.1
N$27
  Top 0.406: LED4.C R25.1
N$28
  Top 0.406: R26.1 LED5.C
N$29
  Top 0.406: R27.1 LED6.C
N$30
  Top 0.406: R28.1 LED7.C
N$31
  Top 0.406: R29.1 LED8.C
N$32
  Top 0.406: R30.1 LED9.C
N$33
  Top 0.406: LED6.A 83.53,41.72 IC5.1
N$34
  Top 0.406: IC5.7 71.88,40.39 73.03,39.24 84.23,39.24 85.6,37.87 85.6,35.84 LED7.A
N$35
  Top 0.406: IC5.8 72.39,37.03 72.39,37.8 72.66,38.07 83.28,38.07 84.94,36.42 84.94,34.36 87.15,32.14 LED8.A
N$36
  Top 0.406: IC5.14 83.4,36.52 84.28,35.64 84.28,34.08 85.6,32.76 85.6,28.22 LED9.A
N$38
  Top 0.406: C4.1 59.69,53.02 61.05,51.66 61.05,49.68 60.78,49.41 58.67,49.41 U1.4
N$39  (via drill 0.35)
  Top 0.406: S2.4 38.05,69.48 41.55,69.48 45.99,73.91 v50.8,73.91 | S1.2 53.37,73.94 v53.34,73.91
  Bottom 0.406: v53.34,73.91 v50.8,73.91
N$40
  Top 0.406: S1.5 53.83,68.3 52.8,69.33 51.42,69.33 50.39,68.3 S2.6
N$41
  Top 0.406: D1.K 81.28,20.32 R31.2
N$42
  Top 0.406: D2.K 77.47,21.59 R32.2
N$43
  Top 0.406: R33.2 73.66,21.59 72.52,20.45 68.71,20.45 D3.K
N$44
  Top 2.54: F1.2 13.36,67.92 19.05,62.23 SW4.COM
N$45
  Top 0.406: LED3.A 85.77,49.53 83.33,51.97 73.76,51.97 72.39,53.34 IC4.7
N$46
  Top 0.406: LED4.A 84.58,48.29 84.58,49.78 83.06,51.31 73.45,51.31 72.39,50.25 IC4.8
N$47
  Top 0.406: IC4.14 80.83,49.47 87.15,43.15 LED5.A
N$48
  Top 1.27: F2.1 45.72,11.58 PS1.3
N$49
  Top 0.406: C12.1 50.04,19.79 49.53,19.28
  Top 1.27: F2.2 40.79,23.98 45.49,19.28 49.53,19.28 U3.3
V_OUT
  Top 0.406: IC2.1 38.86,33.02 40.64,31.24 40.64,30.07 R5.1
V_SET  (via drill 0.35)
  Top 0.406: IC2.3 38.35,35.56 v40.89,38.1 | v40.89,41.66 37.85,41.66 36.99,42.51 36.99,43.53 38.1,44.64 38.1,56.9 47.24,66.04 49.28,66.04 v49.78,66.55 | v65.28,73.91 65.25,73.94 58.83,73.94 57.8,72.91 52.91,72.91 | 52.91,72.91 52.11,73.71 S1.1 | S3.2 69.82,73.91 v68.58,73.91 | 52.91,72.91 52.58,72.91 51.47,71.8 51.47,71.53 v49.78,69.85 TP_VSET.TP
  Bottom 0.406: v40.89,38.1 v40.89,41.66 42.42,43.18 TEST_PADS.4 | v65.28,73.91 v68.58,73.91 | v49.78,69.85 v49.78,66.55
V_SET_MICRO
  Top 0.406: J3.5 103.12,67.06 78.77,67.06 73.06,72.76 68.53,72.76 S3.1
V_SET_POT  (via drill 0.35)
  Top 0.406: S3.3 72.38,73.91 v73.66,73.91 | v65.53,70.61 65.53,67.73 v63.67,65.87 | v35.31,52.83 34.69,52.83 R2.2 | v42.67,52.83 52.73,52.83 52.83,52.73 54.97,54.86 54.97,57.16 v57.45,59.65
  Bottom 0.406: v73.66,73.91 72.39,72.64 72.15,72.64 72.03,72.76 67.67,72.76 65.53,70.63 v65.53,70.61 | v35.31,52.83 v42.67,52.83 | v57.45,59.65 v63.67,65.87
VCC  (via drill 0.35, 1)
  Top 0.406: C3.+ 109.84,37.15 C13.1 103.19,37.15 IC3.1 102.08,37.62 102.08,38.56 101.6,39.05 101.6,39.12 101.09,39.62 99.06,39.62 | 99.06,55.88 v101.6,55.88 TP_VCC.TP | S1.3 55.91,73.94 v55.88,73.91 | TEST_PADS.3 54.1,41.15 54.1,38.86 50.8,35.56 50.8,33.78 45.97,28.96 v45.21,28.96 | 99.06,17.78 110.49,17.78 JP2.1 JP2.2
  Top 1.27: J2.P$2 99.06,57.15 99.06,55.88 99.06,39.62 99.06,17.78 96.52,15.24 | J9.P$1 96.52,15.24 | 96.52,15.24 v95.25,16.51 | v28.7,21.59 23.62,26.67 U$1.P$3
  Bottom 0.406: J3.3 v101.6,55.88 | v55.88,73.91 64.1,73.91 64.93,74.75 74.01,74.75 74.5,74.26 74.5,73.33 75.44,72.39 J2.P$4 | v45.21,28.96 37.85,21.59 36.83,21.59
  Bottom 1.27: v95.25,16.51 93.98,16.51 | J2.P$4 J2.P$2 | v28.7,21.59 36.83,21.59 88.9,21.59 93.98,16.51 | 93.98,16.51 96.52,13.97 J9.P$1
VIN  (via drill 0.35)
  Top 0.406: IC5.4 75.7,40.94 76.5,40.13 v81.03,40.13 | IC2.4 36.38,37.34 35.6,37.34 35.35,37.59 v34.8,37.59 | v58.67,39.66 59.54,40.53 U2.1 59.58,40.92 60.21,40.92 60.73,41.44 60.73,42.38 60.21,42.9 59.58,42.9 U2.3 | v60.71,48.51 60.13,47.94 U1.3 59.03,47.94 58.55,47.46 58.55,46.35 58.86,46.04 U1.1 | v32.69,42.06 R20.2
  Top 1.27: 21.59,57.15 19.05,54.61 R19.1 | F3.1 34.19,23.98 34.8,23.37 34.8,16 PS1.1
  Top 2.032: SW4.ON2 23.75,59.31
  Top 2.54: J7.P$1 81.28,15.24 | 23.75,59.31 21.59,57.15
  Bottom 0.406: v81.03,40.13 83.31,37.85 v83.31,35.31 | v32.69,42.06 33.78,40.97 33.78,38.61 v34.8,37.59 | v55.63,39.62 58.64,39.62 v58.67,39.66 61.98,42.96 v61.98,45.47 61.98,47.24 v60.71,48.51
  pour Top: 113.97,0 0,0 0,76.19 113.97,76.19
VOLT_RANGE  (via drill 0.35)
  Top 0.406: S2.2 40.61,73.94 v40.64,73.91 | v51.56,66.55 52.07,66.55 52.83,65.79 60.71,65.79 66.19,60.3 R6.2
  Bottom 0.406: v40.64,73.91 44.2,70.36 49.11,70.36 49.44,70.69 50.13,70.69 50.46,70.36 51.31,70.36 51.56,70.1 v51.56,66.55

### Text on the board
tPlace: VOLTS | AMPS | SET | ACTUAL | USB | MANUAL | 0-10V | GND | ON | OFF | 1V | 10V | ISET | IOUT | VOLT | CURR | VOUT | 12VDC @ 5A / Ctr Positive | GND | ↓ TOASTY ↓ | Mark Gilliland / 2019 | VOUT | 5V-SUP | 3.3V-SUP | 1A | 1A | 2A / 5A | 1A | Power Supply / Bench Buddy
tNames: Rev1.0
211bmp: ON | OFF | VOLTS | AMPS | SET | ACTUAL | USB | MANUAL | 0-10V | GND | METER | 10V | 1.0A | - + | - + | VOLT | AMP | 0V | 0.0A | 3.3V | 5V | 12V | GND | 3.3V | 5V | 12V | GND | 0-10V | FGEN